# Altium project Suction.PrjPcb
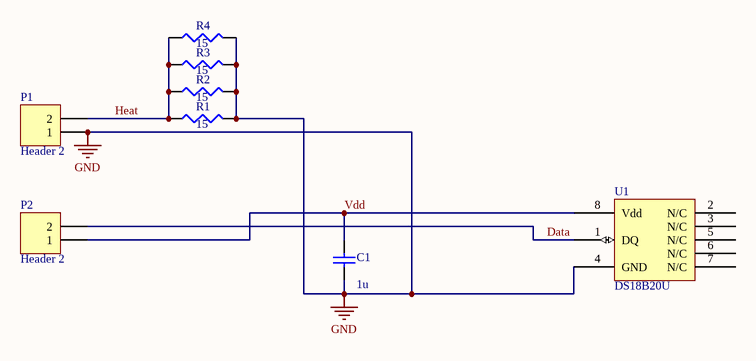
[diagram p0: TopLevel.SchDoc]
_Revision: 1.1.0
1 sheet, 8 parts. Net scope: global (net labels, ports and power ports of the same name join across sheets).
Board files: PCB1_8.5_short - Assm.PcbDoc, PCB1_8.5_short.PcbDoc, Panel_10x2.PcbDoc

## Sheet TopLevel.SchDoc
size A4

### Parts
C1  1u  [C0805]
P1  Header 2  [HDR1X2-SMT]  (no BOM)
P2  Header 2  [HDR1X2-SMT]  (no BOM)
R1  15  [Res-2512-6332]
R2  15  [Res-2512-6332]
R3  15  [Res-2512-6332]
R4  15  [Res-2512-6332]
U1  DS18B20U  [MSSOP-8]

### Nets
GND: C1.1 P1.1 R1.2 R2.2 R3.2 R4.2 U1.4(GND)
Data: P2.2 U1.1(DQ)
Heat: P1.2 R1.1 R2.1 R3.1 R4.1
Vdd: C1.2 P2.1 U1.8(Vdd)

Not connected (* = marked no-connect by the designer): U1 2(N/C) 3(N/C) 5(N/C) 6(N/C) 7(N/C)

### Library data of the parts
C1 = Cap: Capacitor; Value: 1u; Link: https://au.mouser.com/ProductDetail/Vishay-Vitramon/VJ1206Y105MXJTW1BC?qs=sGAEpiMZZMs0AnBnWHyRQHefeAIkSpb%2FMIV0RdtEp0g%3D
P1 P2 = Header 2: Header, 2-Pin; LatestRevisionDate: 17-Jul-2002; LatestRevisionNote: Re-released for DXP Platform.; Publisher: Altium Limited
R1-R4 = Res3: Resistor; Value: 15; Link: https://au.mouser.com/ProductDetail/Bourns/CRM2010-FX-51R0ELF?qs=%2FxfeZyN5VBcgDrGLY%2FOOpg%3D%3D; PackageReference: R2512
U1 = DS18B20U: Programmable Resolution 1-Wire Digital Thermometer; Link: https://au.mouser.com/ProductDetail/Maxim-Integrated/DS18B20U%2bTR?qs=sGAEpiMZZMvbyeSUH4qH%2FCjwslw0Uk0S

## Assembly variants
SingleR: not fitted R1 R2 R4